# EAGLE design schematic (EAGLE 6.4)
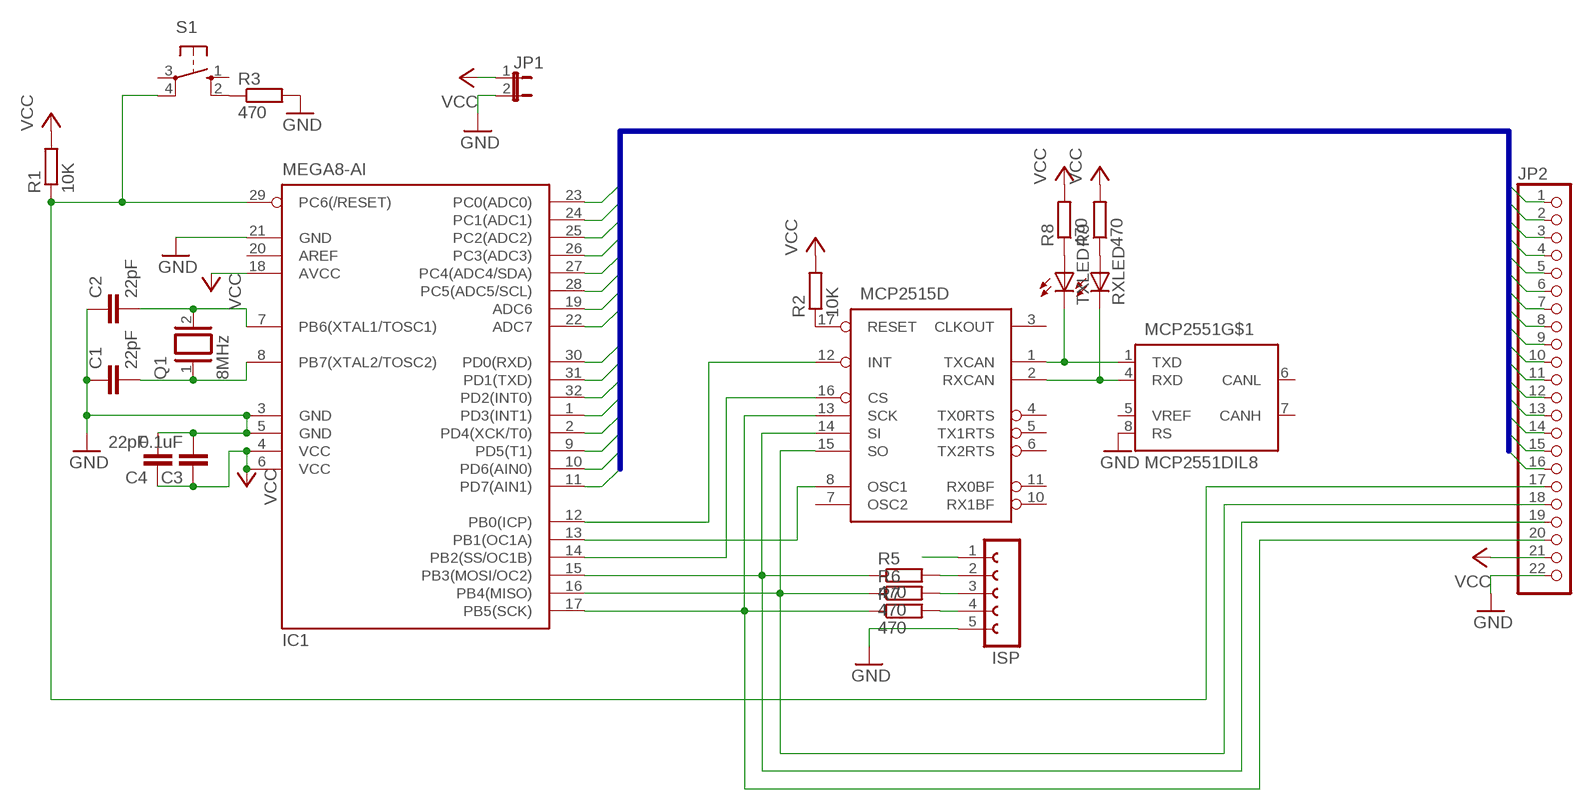
[diagram p0: schematic, sheet 1]

## Parts
C1  22pF  C-EUC0603  [C0603]
C2  22pF  C-EUC0603  [C0603]
C3  0.1uF  C-EUC0603  [C0603]
C4  22pF  C-EUC0603  [C0603]
IC1  MEGA8-AI  [TQFP32-08]
ISP  FE05-1  [FE05-1]
JP1  JUMPER-2PTH  [1X02]
JP2  PINHD-1X22/90  [1X22/90]
MCP2515  MCP2515P  [DIL18]
MCP2551  MCP2551DIL8  [DIL08]
Q1  8MHz  XTAL/S  [QS]
R1  10K  R-EU_R0603  [R0603]
R2  10K  R-EU_R0603  [R0603]
R3  470  R-EU_R0603  [R0603]
R5  470  R-EU_R0603  [R0603]
R6  470  R-EU_R0603  [R0603]
R7  470  R-EU_R0603  [R0603]
R8  470  R-EU_R0603  [R0603]
R9  470  R-EU_R0603  [R0603]
RXLED  LED  [SMARTLED-TTW]
S1  10-XX  [B3F-10XX]
TXLED  LED  [SMARTLED-TTW]

## Nets
GND: C1.1 C2.1 C3.2 C4.2 IC1.3(GND) IC1.5(GND) IC1.21(GND) ISP.5 JP1.2 JP2.22 MCP2551.8(RS) R3.2
N$1: IC1.17(PB5(SCK)) JP2.20 MCP2515.13(D:SCK) R7.1
N$2: IC1.16(PB4(MISO)) JP2.18 MCP2515.15(D:SO) R6.1
N$3: IC1.15(PB3(MOSI/OC2)) JP2.19 MCP2515.14(D:SI) R5.1
N$4: IC1.14(PB2(SS/OC1B)) MCP2515.16(D:CS)
N$5: IC1.13(PB1(OC1A)) MCP2515.8(D:OSC1)
N$7: MCP2515.1(D:TXCAN) MCP2551.1(TXD) TXLED.C@1(C)
N$9: C1.2 IC1.8(PB7(XTAL2/TOSC2)) Q1.1
N$10: C2.2 IC1.7(PB6(XTAL1/TOSC1)) Q1.2
N$12: MCP2515.17(D:RESET) R2.1
N$13: R3.1 S1.2(S1)
N$14: IC1.12(PB0(ICP)) MCP2515.12(D:INT)
N$15: ISP.2 R5.2
N$16: ISP.3 R6.2
N$17: ISP.4 R7.2
N$18: R8.1 TXLED.A@1(A)
N$19: R9.1 RXLED.A@1(A)
PC0: IC1.23(PC0(ADC0)) JP2.1
PC1: IC1.24(PC1(ADC1)) JP2.2
PC2: IC1.25(PC2(ADC2)) JP2.3
PC3: IC1.26(PC3(ADC3)) JP2.4
PC4: IC1.27(PC4(ADC4/SDA)) JP2.5
PC5: IC1.28(PC5(ADC5/SCL)) JP2.6
PC6: IC1.19(ADC6) JP2.7
PC7: IC1.22(ADC7) JP2.8
PD0: IC1.30(PD0(RXD)) JP2.9
PD1: IC1.31(PD1(TXD)) JP2.10
PD2: IC1.32(PD2(INT0)) JP2.11
PD3: IC1.1(PD3(INT1)) JP2.12
PD4: IC1.2(PD4(XCK/T0)) JP2.13
PD5: IC1.9(PD5(T1)) JP2.14
PD6: IC1.10(PD6(AIN0)) JP2.15
PD7: IC1.11(PD7(AIN1)) JP2.16
RESET: IC1.29(PC6(/RESET)) ISP.1 JP2.17 R1.1 S1.4(P1)
RXLED: MCP2515.2(D:RXCAN) MCP2551.4(RXD) RXLED.C@1(C)
VCC: C3.1 C4.1 IC1.4(VCC) IC1.6(VCC) IC1.18(AVCC) JP1.1 JP2.21 R1.2 R2.2 R8.2 R9.2
Unconnected: IC1.20(AREF) MCP2515.3(D:CLKOUT) MCP2515.4(D:TX0RTS) MCP2515.5(D:TX1RTS) MCP2515.6(D:TX2RTS) MCP2515.7(D:OSC2) MCP2515.10(D:RX1BF) MCP2515.11(D:RX0BF) MCP2551.5(VREF) MCP2551.6(CANL) MCP2551.7(CANH) S1.1(S) S1.3(P)

## Buses
PC[0..7],PD[0..7]

## Power pins joined to a net without a drawn wire
GND: MCP2515.9(P:GND) MCP2551.2(GND)
VCC: MCP2515.18(P:VCC) MCP2551.3(VCC)

## Library data of the parts
C1-C4 = resistor:C-EU: CAPACITOR, European symbol; OC_NEWARK: unknown
IC1 = atmel:MEGA8: MICROCONTROLLER 8 Kbytes FLASH, 1 kbytes SRAM, 512 bytes EEPROM, USART, 6-channel 10 bit ADC, 2-channel 8 bit ADC Pin compatible with Atmega48, ATMega88, ATMega168 Source: avr.lbr; MPN: ATMEGA8-16AU; OC_FARNELL: 9171371; OC_NEWARK: unknown
ISP = con-lsta:FE05-1: FEMALE HEADER; OC_FARNELL: unknown; OC_NEWARK: unknown
JP1 = SparkFun-Passives:JUMPER-2: Jumper Basic 0.1" spaced jumper. Use with breakaway headers.
JP2 = pinhead:PINHD-1X22: PIN HEADER
MCP2515 = can:MCP2515: MC2515 Stand-Alone CAN Controller With SPI Interface, Microchip; OC_NEWARK: unknown
MCP2551 = can:MCP2551: CAN Tranceiver Microchip; OC_NEWARK: unknown
Q1 = special:XTAL/S: CRYSTAL; OC_NEWARK: unknown
R1-R3 R5-R9 = resistor:R-EU_: RESISTOR, European symbol; OC_NEWARK: unknown
RXLED TXLED = led:LED: LED OSRAM: - CHIPLED LG R971, LG N971, LY N971, LG Q971, LY Q971, LO R971, LY R971 LH N974, LH R974 LS Q976, LO Q976, LY Q976 LO Q996 - Hyper CHIPLED LW Q18S LB Q993, LB Q99A, LB R99A - SideLED LS A670, LO A670, LY A670, LG A670, LP A670 LB A673, LV A673, LT A673, LW A673 LH A674 LY A675 LS A676, LA A676, LO A676, LY A676, LW A676 LS A679, LY A679, LG A679 - Hyper Micro SIDELED® LS Y876, LA Y876, LO Y876, LY Y876 LT Y87S - SmartLED LW L88C, LW L88S LB L89C, LB L89S, LG L890 LS L89K, LO L89K, LY L89K LS L896, LA L896, LO L896, LY L896 - TOPLED LS T670, LO T670, LY T670, LG T670, LP T670 LSG T670, LSP T670, LSY T670, LOP T670, LYG T670 LG T671, LOG T671, LSG T671 LB T673, LV T673, LT T673, LW T673 LH T674 LS T676, LA T676, LO T676, LY T676, LB T676, LH T676, LSB T676, LW T676 LB T67C, LV T67C, LT T67C, LS T67K, LO T67K, LY T67K, LW E67C LS E67B, LA E67B, LO E67B, LY E67B, LB E67C, LV E67C, LT E67C LW T67C LS T679, LY T679, LG T679 LS T770, LO T770, LY T770, LG T770, LP T770 LB T773, LV T773, LT T773, LW T773 LH T774 LS E675, LA E675, LY E675, LS T675 LS T776, LA T776, LO T776, LY T776, LB T776 LHGB T686 LT T68C, LB T68C - Hyper Mini TOPLED® LB M676 - Mini TOPLED Santana® LG M470 LS M47K, LO M47K, LY M47K Source: http://www.osram.convergy.de LUXEON: - LUMILED® LXK2-PW12-R00, LXK2-PW12-S00, LXK2-PW14-U00, LXK2-PW14-V00 LXK2-PM12-R00, LXK2-PM12-S00, LXK2-PM14-U00 LXK2-PE12-Q00, LXK2-PE12-R00, LXK2-PE12-S00, LXK2-PE14-T00, LXK2-PE14-U00 LXK2-PB12-K00, LXK2-PB12-L00, LXK2-PB12-M00, LXK2-PB14-N00, LXK2-PB14-P00, LXK2-PB14-Q00 LXK2-PR12-L00, LXK2-PR12-M00, LXK2-PR14-Q00, LXK2-PR14-R00 LXK2-PD12-Q00, LXK2-PD12-R00, LXK2-PD12-S00 LXK2-PH12-R00, LXK2-PH12-S00 LXK2-PL12-P00, LXK2-PL12-Q00, LXK2-PL12-R00 Source: www.luxeon.com KINGBRIGHT: KA-3528ASYC Source: www.kingbright.com; OC_NEWARK: unknown
S1 = switch-omron:10-XX: OMRON SWITCH; MPN: B3F-1000; OC_FARNELL: 176432; OC_NEWARK: 36M3542

## Board
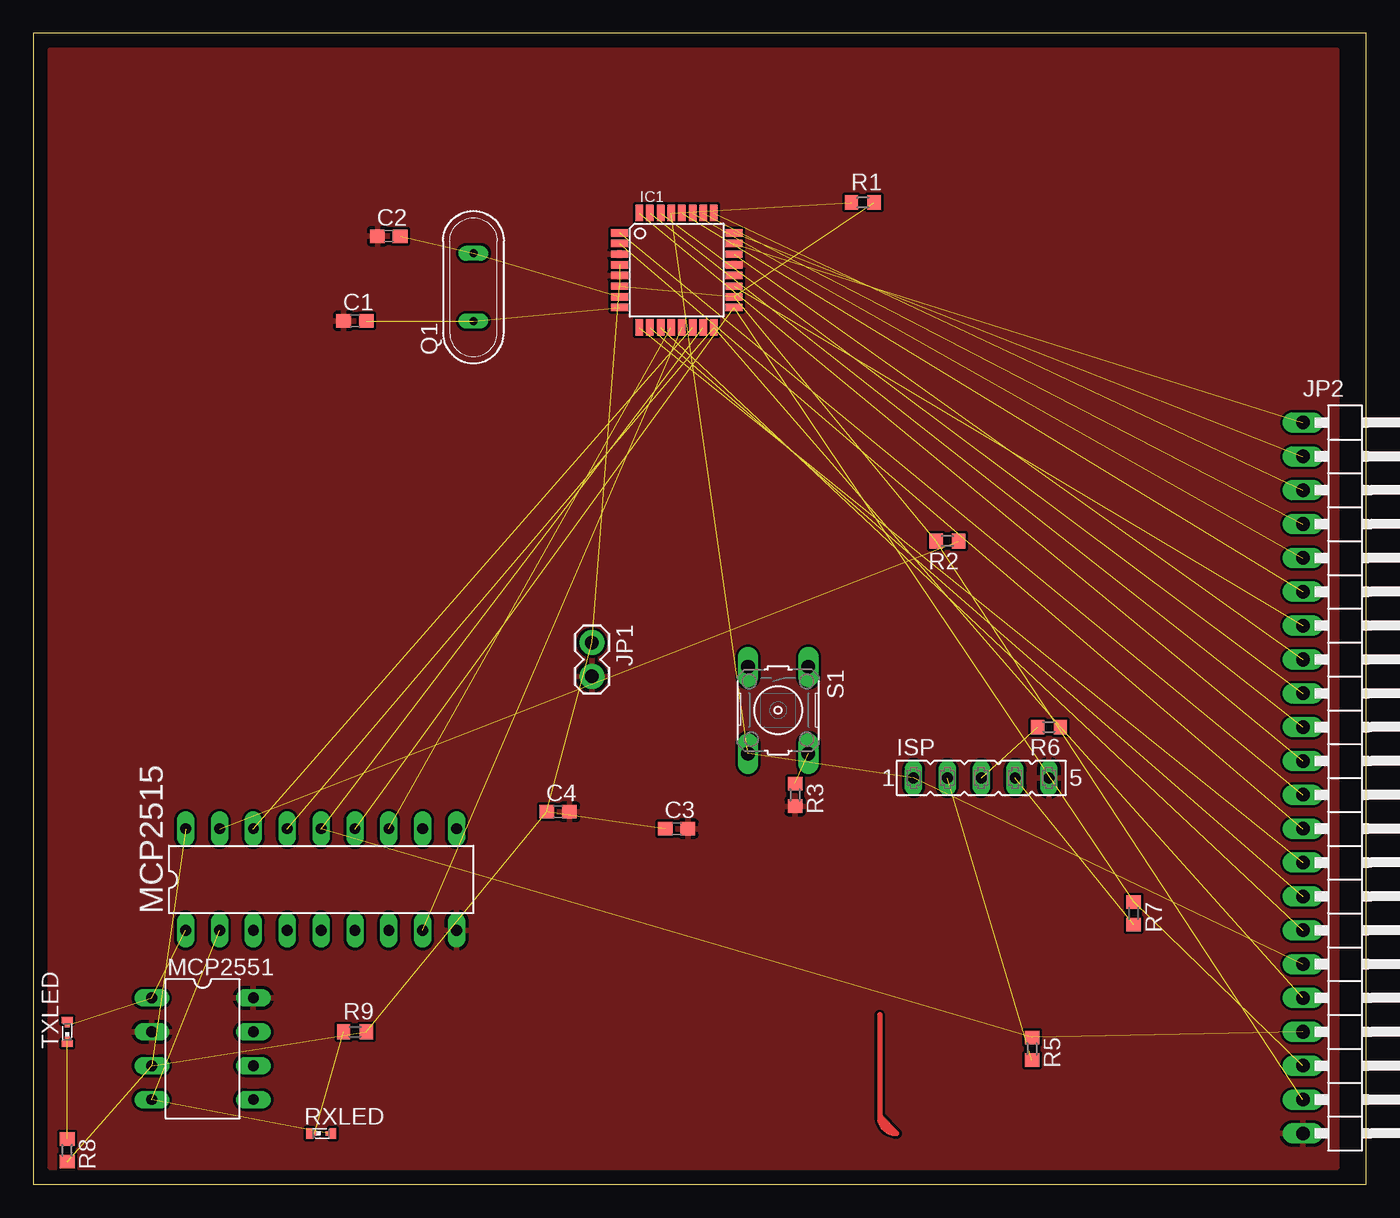
[diagram p1: board, top side]

Size 100 x 86.35 mm. Coordinates in mm from the lower left corner, seen from the top.
Outline: 0,0 100,0 100,86.35 0,86.35 0,0
Copper layers (1*16): Top 0.035mm / dielectric 1.5mm / Bottom 0.035mm
Design rules "default": minimum track width 10mil, minimum drill 24mil, track to track 8mil, track to pad 8mil, pad to pad 8mil, via to via 8mil, smd to smd 8mil, copper to edge 40mil, drill to drill 8mil, minimum pad ring 10mil, minimum via ring 8mil, stop-mask expansion 4mil, vias tented up to drill 0mil, thermal gap 10mil

### Footprints (pad centres in the part's own frame; a part is rotated, then mirrored left to right if it is on the bottom)
C0603 = smd 1.1 x 1: 1 -0.85,0; 2 0.85,0
TQFP32-08 = smd 1.27 x 0.559: 1 -4.293,2.8; 2 -4.293,2; 3 -4.293,1.2; 4 -4.293,0.4; 5 -4.293,-0.4; 6 -4.293,-1.2; 7 -4.293,-2; 8 -4.293,-2.8; 17 4.293,-2.8; 18 4.293,-2; 19 4.293,-1.2; 20 4.293,-0.4; 21 4.293,0.4; 22 4.293,1.2; 23 4.293,2; 24 4.293,2.8 | smd 0.559 x 1.27: 9 -2.8,-4.293; 10 -2,-4.293; 11 -1.2,-4.293; 12 -0.4,-4.293; 13 0.4,-4.293; 14 1.2,-4.293; 15 2,-4.293; 16 2.8,-4.293; 25 2.8,4.293; 26 2,4.293; 27 1.2,4.293; 28 0.4,4.293; 29 -0.4,4.293; 30 -1.2,4.293; 31 -2,4.293; 32 -2.8,4.293
FE05-1 = drill 0.813 long: 1 -5.08,0; 2 -2.54,0; 3 0,0; 4 2.54,0; 5 5.08,0
1X02 = drill 1.016 pad 1.88: 1 0,0; 2 2.54,0
1X22/90 = drill 1.016 long: 1 -26.67,-3.81; 2 -24.13,-3.81; 3 -21.59,-3.81; 4 -19.05,-3.81; 5 -16.51,-3.81; 6 -13.97,-3.81; 7 -11.43,-3.81; 8 -8.89,-3.81; 9 -6.35,-3.81; 10 -3.81,-3.81; 11 -1.27,-3.81; 12 1.27,-3.81; 13 3.81,-3.81; 14 6.35,-3.81; 15 8.89,-3.81; 16 11.43,-3.81; 17 13.97,-3.81; 18 16.51,-3.81; 19 19.05,-3.81; 20 21.59,-3.81; 21 24.13,-3.81; 22 26.67,-3.81
DIL18 = drill 0.813 long: 1 -10.16,-3.81; 2 -7.62,-3.81; 3 -5.08,-3.81; 4 -2.54,-3.81; 5 0,-3.81; 6 2.54,-3.81; 7 5.08,-3.81; 8 7.62,-3.81; 9 10.16,-3.81; 10 10.16,3.81; 11 7.62,3.81; 12 5.08,3.81; 13 2.54,3.81; 14 0,3.81; 15 -2.54,3.81; 16 -5.08,3.81; 17 -7.62,3.81; 18 -10.16,3.81
DIL08 = drill 0.813 long: 1 -3.81,-3.81; 2 -1.27,-3.81; 3 1.27,-3.81; 4 3.81,-3.81; 5 3.81,3.81; 6 1.27,3.81; 7 -1.27,3.81; 8 -3.81,3.81
QS = drill 0.61 long: 1 -2.54,0; 2 2.54,0
R0603 = smd 1 x 1.1: 1 -0.85,0; 2 0.85,0
SMARTLED-TTW = smd 0.8 x 0.5: A 0,-0.875; C 0,0.875 | smd 0.35 x 0.35: A@1 0,-0.5; C@1 0,0.5
B3F-10XX = drill 1.016 long: 1 -3.251,2.261; 2 3.251,2.261; 3 -3.251,-2.261; 4 3.251,-2.261

### Placement (x,y rotation side)
C1  24.13,64.77 0 top
C2  26.67,71.12 0 top
C3  48.26,26.67 0 top
C4  39.37,27.94 0 top
IC1  48.26,68.58 0 top
ISP  71.12,30.48 0 top
JP1  41.91,40.64 270 top
JP2  99.06,30.48 270 top
MCP2515  21.59,22.86 0 top
MCP2551  12.7,10.16 270 top
Q1  33.02,67.31 90 top
R1  62.23,73.66 0 top
R2  68.58,48.26 180 top
R3  57.15,29.21 270 top
R5  74.93,10.16 270 top
R6  76.2,34.29 180 top
R7  82.55,20.32 270 top
R8  2.54,2.54 270 top
R9  24.13,11.43 0 top
RXLED  21.59,3.81 270 top
S1  55.88,35.56 270 top
TXLED  2.54,11.43 0 top

### Tracks (layer width: path | path; a pad name or v marks a point on that pad's centre or on a via)
GND
  pour Top: 1.27,85.09 97.79,85.09 97.79,82.55 97.79,5.08 97.79,1.27 1.27,1.27
N$1  (3 unrouted)
N$2  (3 unrouted)
N$3  (3 unrouted)
N$4  (1 unrouted)
N$5  (1 unrouted)
N$7  (2 unrouted)
N$8
  Top 0.406: 63.5,12.7 63.5,11.43 63.5,5.08 | 63.5,5.08 64.77,3.81 arc-90 63.5,5.08
N$9  (2 unrouted)
N$10  (2 unrouted)
N$12  (1 unrouted)
N$13  (1 unrouted)
N$14  (1 unrouted)
N$15  (1 unrouted)
N$16  (1 unrouted)
N$17  (1 unrouted)
N$18  (1 unrouted)
N$19  (1 unrouted)
PC0  (1 unrouted)
PC1  (1 unrouted)
PC2  (1 unrouted)
PC3  (1 unrouted)
PC4  (1 unrouted)
PC5  (1 unrouted)
PC6  (1 unrouted)
PC7  (1 unrouted)
PD0  (1 unrouted)
PD1  (1 unrouted)
PD2  (1 unrouted)
PD3  (1 unrouted)
PD4  (1 unrouted)
PD5  (1 unrouted)
PD6  (1 unrouted)
PD7  (1 unrouted)
RESET  (4 unrouted)
RXLED  (2 unrouted)
VCC  (12 unrouted)